# Altium project GatorSynth_Step_Sequencer.PrjPcb (part 2 of 2)

## Sheet CV_Control.SchDoc
size Letter
Used 2 times, as channels CV Control, CV Control. Parts and nets are listed once, with the designators drawn on the sheet.
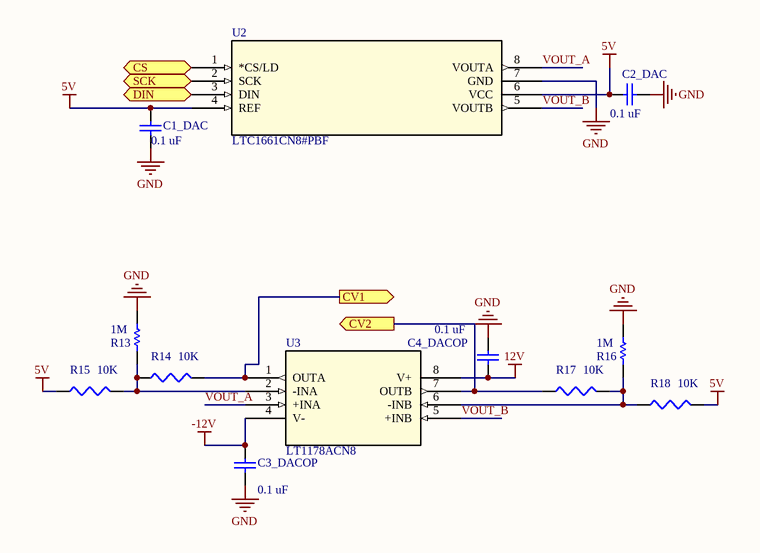
[diagram p11: CV_Control.SchDoc]

### Parts
C1_DAC  value 0.1 uF  [C0805]
C2_DAC  value 0.1 uF  [C0805]
C3_DACOP  value 0.1 uF  [C0805]
C4_DACOP  value 0.1 uF  [C0805]
R13  value 1M  [AXIAL-0.3]  (hidden comment: Res1)
R14  value 10K  [J1-0603]  (hidden comment: Res3)
R15  value 10K  [J1-0603]  (hidden comment: Res3)
R16  value 1M  [AXIAL-0.3]  (hidden comment: Res1)
R17  value 10K  [J1-0603]  (hidden comment: Res3)
R18  value 10K  [J1-0603]  (hidden comment: Res3)
U2  LTC1661CN8#PBF  [PDIP-8_N]
U3  LT1178ACN8  [PDIP-8_N]

### Ports
CS (in), CV1 (out), CV2 (out), DIN (in), SCK (in)

### Nets
5V: C1_DAC.2 C2_DAC.1 R15.1 R18.2 U2.4(REF) U2.6(VCC)
12V: C4_DACOP.1 U3.8(V+)
-12V: C3_DACOP.1 U3.4(V-)
GND: C1_DAC.1 C2_DAC.2 C3_DACOP.2 C4_DACOP.2 R13.2 R16.2 U2.7(GND)
CS: U2.1(*CS/LD) ; port CS
CV1: R14.2 U3.1(OUTA) ; port CV1
CV2: R17.1 U3.7(OUTB) ; port CV2
DIN: U2.3(DIN) ; port DIN
SCK: U2.2(SCK) ; port SCK
VOUT_A: U2.8(VOUTA) U3.3(+INA)
VOUT_B: U2.5(VOUTB) U3.5(+INB)
NetR13_1: R13.1 R14.1 R15.2 U3.2(-INA)
NetR16_1: R16.1 R17.2 R18.1 U3.6(-INB)

### Channels
CV Control: designators end in _CV_Control#1; ports CS=CS1 CV1=CV1 CV2=CV2 DIN=MOSI SCK=SPCK
CV Control: designators end in _CV_Control#2; ports CS=CS2 CV1=CV3 CV2=CV4 DIN=MOSI SCK=SPCK

### Library data of the parts
C1_DAC C2_DAC C3_DACOP C4_DACOP = Cap: Capacitor; Published: 8-Jun-2000; LatestRevisionDate: 17-Jul-2002; LatestRevisionNote: Re-released for DXP Platform.; PackageReference: RAD-0.3; Publisher: Altium Limited; PackageDescription: Radial Cap, Thru-Hole; 2 Leads; 0.3 in Pin Spacing
R13 R16 = Res1: Resistor; Published: 8-Jun-2000; LatestRevisionDate: 17-Jul-2002; LatestRevisionNote: Re-released for DXP Platform.; PackageReference: AXIAL-0.3; Publisher: Altium Limited; PackageDescription: Axial Device, Thru-Hole; 2 Leads; 0.3 in Pin Spacing
R14 R15 R17 R18 = Res3: Resistor; Published: 8-Jun-2000; LatestRevisionDate: 29-May-2009; LatestRevisionNote: IPC-7351 Footprint Added.; PackageReference: J1-0603; Publisher: Altium Limited; PackageDescription: Chip Resistor
U2 = LTC1661CN8#PBF: Imported; Vendor: Linear Technology; Manufacturer_Part_Number: LTC1661CN8#PBF; Value: Value; Type: Type; RefDes: RefDes
U3 = LT1632CN8#PBF: Imported; Operating_Temperature: 0Â°C ~ 70Â°C; Current_-_Output_/_Channel: 70mA; Voltage_-_Input_Offset: 500ÂµV; Current_-_Input_Bias: 1.15ÂµA; Output_Type: Rail-to-Rail; Vendor: Linear Technology; Amplifier_Type: General Purpose; Number_of_Circuits: 2; Slew_Rate: 45 V/Âµs; Gain_Bandwidth_Product: 45MHz; Current_-_Supply: 4.6mA; Current_-_Output/Channel: 40mA; Voltage_-_Supply,_Single/Dual_(Â±): 2.7 V ~ 36 V, Â±1.35 V ~ 18 V; Mounting_Type: Through Hole; 3D_Library_Name: Maxim2; C: Copyright (C) 2016 Accelerated Designs. All rights reserved; -3db_Bandwidth: -; Series: *; Manufacturer_Part_Number: LT1632CN8#PBF; DigiKeyPartNumber: LT1632CN8-ND; Quantity_Available: 0; DataSheet: http://www.linear.com/docs/3055; Packaging: Tube; Package_/_Case: 8-DIP (0.300", 7.62mm); Copyright: Copyright (C) 2015 Accelerated Designs. All rights reserved; Supplier_Device_Package: 8-PDIP; Value: Value; Type: Type; RefDes: RefDes

## Sheet Ribbon_Connectors.SchDoc
size Letter
Used 5 times, as channels U_Ribbon_Connectors, U_Ribbon_Connectors, U_Ribbon_Connectors, U_Ribbon_Connectors, U_Ribbon_Connectors. Parts and nets are listed once, with the designators drawn on the sheet.
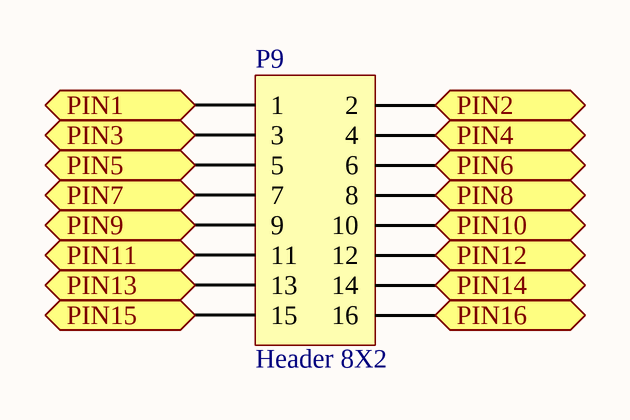
[diagram p12: Ribbon_Connectors.SchDoc]

### Parts
P9  Header 8X2  [HDR2X8]

### Ports
PIN1, PIN2, PIN3, PIN4, PIN5, PIN6, PIN7, PIN8, PIN9, PIN10, PIN11, PIN12, PIN13, PIN14, PIN15, PIN16

### Nets
PIN1: P9.1 ; port PIN1
PIN2: P9.2 ; port PIN2
PIN3: P9.3 ; port PIN3
PIN4: P9.4 ; port PIN4
PIN5: P9.5 ; port PIN5
PIN6: P9.6 ; port PIN6
PIN7: P9.7 ; port PIN7
PIN8: P9.8 ; port PIN8
PIN9: P9.9 ; port PIN9
PIN10: P9.10 ; port PIN10
PIN11: P9.11 ; port PIN11
PIN12: P9.12 ; port PIN12
PIN13: P9.13 ; port PIN13
PIN14: P9.14 ; port PIN14
PIN15: P9.15 ; port PIN15
PIN16: P9.16 ; port PIN16

### Channels
U_Ribbon_Connectors: designators end in _U_Ribbon_Connectors#1; ports PIN1=NE_L0 PIN2=NE_R0 PIN3=NE_L1 PIN4=NE_R1 PIN5=NE_L2 PIN6=NE_R2 PIN7=NE_L3 PIN8=NE_R3 PIN9=NE_L4 PIN10=NE_R4 PIN11=NE_L5 PIN12=NE_R5 PIN13=NE_L6 PIN14=NE_R6 PIN15=NE_L7 PIN16=NE_R7
U_Ribbon_Connectors: designators end in _U_Ribbon_Connectors#2; ports PIN1=NE_L8 PIN2=NE_R8 PIN3=NE_L9 PIN4=NE_R9 PIN5=NE_L10 PIN6=NE_R10 PIN7=NE_L11 PIN8=NE_R11 PIN9=NE_L12 PIN10=NE_R12 PIN11=NE_L13 PIN12=NE_R13 PIN13=NE_L14 PIN14=NE_R14 PIN15=NE_L15 PIN16=NE_R15
U_Ribbon_Connectors: designators end in _U_Ribbon_Connectors#3; ports PIN1=AE_L0 PIN2=AE_R0 PIN3=AE_L1 PIN4=AE_R1 PIN5=AE_L2 PIN6=AE_R2 PIN7=AE_L3 PIN8=AE_R3 PIN9=AE_L4 PIN10=AE_R4 PIN11=AE_L5 PIN12=AE_R5 PIN13=AE_L6 PIN14=AE_R6 PIN15=AE_L7 PIN16=AE_R7
U_Ribbon_Connectors: designators end in _U_Ribbon_Connectors#4; ports PIN1=ENC_INT PIN2=BTN_INT PIN3=SDA PIN4=SCL PIN5=MOSI PIN6=SPCK PIN7=NOTE_LEN PIN8=DISP_SEL0 PIN9=DISP_SEL1 PIN10=DISP_SEL2 PIN11=DISP_RESET PIN12=PP_BTN PIN13=PP_LED PIN14=NetP9_U_Ribbon_Connectors#4_14 PIN15=NetP9_U_Ribbon_Connectors#4_15 PIN16=NetP9_U_Ribbon_Connectors#4_16
U_Ribbon_Connectors: designators end in _U_Ribbon_Connectors#5; ports PIN1=12V PIN2=12V PIN3=12V PIN4=12V PIN5=12V PIN6=3.3V PIN7=3.3V PIN8=3.3V PIN9=3.3V PIN10=3.3V PIN11=GND PIN12=GND PIN13=GND PIN14=GND PIN15=GND PIN16=GND

### Library data of the parts
P9 = Header 8X2: Header, 8-Pin, Dual row; LatestRevisionDate: 17-Jul-2002; LatestRevisionNote: Re-released for DXP Platform.; Publisher: Altium Limited

## Nets that join several sheets
3.3V: Top_Level (R4.2 R25.2), Programmer (J4.1), Processor (12 pins), Buttons (16 pins), Jack_In (R31.2), Digital_Io (C1_IOOP.1 U5.8), ButtonExpanders (8 pins), NoteExpanders (8 pins), Power (C7_PWR.2 C28.1 L1.2 R33.1), Display_Mux (U8.16), U_Ribbon_Connectors (5 pins)
5V: Power (C1_PWR.2 C4_PWR.1 P9.5 P9.6), CV Control (6 pins), CV Control (6 pins)
12V: Gate Control (C2_GC_Gate_Control#1.1 U4_Gate_Control#1.8), Buttons (16 pins), Digital_Io (C3_IOOP.1 U6.8), Power (8 pins), Gate Control (C2_GC_Gate_Control#2.1 U4_Gate_Control#2.8), CV Control (C4_DACOP_CV_Control#1.1 U3_CV_Control#1.8), CV Control (C4_DACOP_CV_Control#2.1 U3_CV_Control#2.8), U_Ribbon_Connectors (5 pins)
-12V: Gate Control (C1_GC_Gate_Control#1.2 U4_Gate_Control#1.4), Digital_Io (C2_IOOP.2 U6.4), Power (C3_PWR.2 C6_PWR.2 P9.15 P9.16), Gate Control (C1_GC_Gate_Control#2.2 U4_Gate_Control#2.4), CV Control (C3_DACOP_CV_Control#1.1 U3_CV_Control#1.4), CV Control (C3_DACOP_CV_Control#2.1 U3_CV_Control#2.4)
GND: Top_Level (5 pins), Programmer (J4.3 J4.5 J4.9), Gate Control (C1_GC_Gate_Control#1.1 C2_GC_Gate_Control#1.2 R20_Gate_Control#1.1 R22_Gate_Control#1.2), Processor (17 pins), Buttons (36 pins), Jack_In (J6.3 J6.5), Digital_Io (7 pins), ButtonExpanders (C23_ButtonExpanders.2 EXP1_ButtonExpanders.3 EXP1_ButtonExpanders.12), NoteExpanders (C23_NoteExpanders.2 EXP1_NoteExpanders.3 EXP1_NoteExpanders.12), Power (18 pins), Display_Mux (U8.6 U8.7 U8.8), Gate Control (C1_GC_Gate_Control#2.1 C2_GC_Gate_Control#2.2 R20_Gate_Control#2.1 R22_Gate_Control#2.2), CV Control (7 pins), CV Control (7 pins), U_Ribbon_Connectors (6 pins)
AE_L0: Processor (U1.74), U_Ribbon_Connectors (P9_U_Ribbon_Connectors#3.1)
AE_L1: Processor (U1.52), U_Ribbon_Connectors (P9_U_Ribbon_Connectors#3.3)
AE_L2: Processor (U1.48), U_Ribbon_Connectors (P9_U_Ribbon_Connectors#3.5)
AE_L3: Processor (U1.28), U_Ribbon_Connectors (P9_U_Ribbon_Connectors#3.7)
AE_L4: Processor (U1.24), U_Ribbon_Connectors (P9_U_Ribbon_Connectors#3.9)
AE_L5: Processor (U1.20), U_Ribbon_Connectors (P9_U_Ribbon_Connectors#3.11)
AE_L6: Processor (U1.34), U_Ribbon_Connectors (P9_U_Ribbon_Connectors#3.13)
AE_L7: Processor (U1.39), U_Ribbon_Connectors (P9_U_Ribbon_Connectors#3.15)
AE_R0: Processor (U1.72), U_Ribbon_Connectors (P9_U_Ribbon_Connectors#3.2)
AE_R1: Processor (U1.49), U_Ribbon_Connectors (P9_U_Ribbon_Connectors#3.4)
AE_R2: Processor (U1.46), U_Ribbon_Connectors (P9_U_Ribbon_Connectors#3.6)
AE_R3: Processor (U1.12), U_Ribbon_Connectors (P9_U_Ribbon_Connectors#3.8)
AE_R4: Processor (U1.15), U_Ribbon_Connectors (P9_U_Ribbon_Connectors#3.10)
AE_R5: Processor (U1.22), U_Ribbon_Connectors (P9_U_Ribbon_Connectors#3.12)
AE_R6: Processor (U1.38), U_Ribbon_Connectors (P9_U_Ribbon_Connectors#3.14)
AE_R7: Processor (U1.57), U_Ribbon_Connectors (P9_U_Ribbon_Connectors#3.16)
BPM_IN: Jack_In (J6.1), Digital_Io (U5.3)
BPM_OUT: Processor (U1.41), Digital_Io (U6.3)
BPM_TRIG: Processor (U1.53), Digital_Io (C26.1 D1.2 R23.2 U5.1)
BTN_INT: Processor (U1.88), ButtonExpanders (EXP1_ButtonExpanders.1 R10_ButtonExpanders.1), U_Ribbon_Connectors (P9_U_Ribbon_Connectors#4.2)
CS1: Processor (U1.93), CV Control (U2_CV_Control#1.1)
CS2: Processor (U1.99), CV Control (U2_CV_Control#2.1)
DISP_RESET: Processor (U1.81), U_Ribbon_Connectors (P9_U_Ribbon_Connectors#4.11)
DISP_SEL0: Processor (U1.59), Display_Mux (U8.11), U_Ribbon_Connectors (P9_U_Ribbon_Connectors#4.8)
DISP_SEL1: Processor (U1.63), Display_Mux (U8.10), U_Ribbon_Connectors (P9_U_Ribbon_Connectors#4.9)
DISP_SEL2: Processor (U1.64), Display_Mux (U8.9), U_Ribbon_Connectors (P9_U_Ribbon_Connectors#4.10)
ENC_INT: Processor (U1.89), NoteExpanders (EXP1_NoteExpanders.1 R10_NoteExpanders.1), U_Ribbon_Connectors (P9_U_Ribbon_Connectors#4.1)
GATE_OUT1: Processor (U1.3), Gate Control (U4_Gate_Control#2.3)
GATE_OUT2: Processor (U1.5), Gate Control (U4_Gate_Control#2.5)
GATE_OUT3: Gate Control (U4_Gate_Control#1.3), Processor (U1.7)
GATE_OUT4: Gate Control (U4_Gate_Control#1.5), Processor (U1.9)
JACK_INT: Processor (U1.44), Jack_In (J6.4 R31.1)
MOSI: Processor (U1.33), Buttons (DRV1.9), CV Control (U2_CV_Control#1.3), CV Control (U2_CV_Control#2.3), U_Ribbon_Connectors (P9_U_Ribbon_Connectors#4.5)
NE_L0: Processor (U1.25), U_Ribbon_Connectors (P9_U_Ribbon_Connectors#1.1)
NE_L1: Processor (U1.43), U_Ribbon_Connectors (P9_U_Ribbon_Connectors#1.3)
NE_L2: Processor (U1.37), U_Ribbon_Connectors (P9_U_Ribbon_Connectors#1.5)
NE_L3: Processor (U1.32), U_Ribbon_Connectors (P9_U_Ribbon_Connectors#1.7)
NE_L4: Processor (U1.58), U_Ribbon_Connectors (P9_U_Ribbon_Connectors#1.9)
NE_L5: Processor (U1.65), U_Ribbon_Connectors (P9_U_Ribbon_Connectors#1.11)
NE_L6: Processor (U1.23), U_Ribbon_Connectors (P9_U_Ribbon_Connectors#1.13)
NE_L7: Processor (U1.71), U_Ribbon_Connectors (P9_U_Ribbon_Connectors#1.15)
NE_L8: Processor (U1.73), U_Ribbon_Connectors (P9_U_Ribbon_Connectors#2.1)
NE_L9: Processor (U1.78), U_Ribbon_Connectors (P9_U_Ribbon_Connectors#2.3)
NE_L10: Processor (U1.82), U_Ribbon_Connectors (P9_U_Ribbon_Connectors#2.5)
NE_L11: Processor (U1.86), U_Ribbon_Connectors (P9_U_Ribbon_Connectors#2.7)
NE_L12: Processor (U1.92), U_Ribbon_Connectors (P9_U_Ribbon_Connectors#2.9)
NE_L13: Processor (U1.13), U_Ribbon_Connectors (P9_U_Ribbon_Connectors#2.11)
NE_L14: Processor (U1.54), U_Ribbon_Connectors (P9_U_Ribbon_Connectors#2.13)
NE_L15: Processor (U1.6), U_Ribbon_Connectors (P9_U_Ribbon_Connectors#2.15)
NE_R0: Processor (U1.47), U_Ribbon_Connectors (P9_U_Ribbon_Connectors#1.2)
NE_R1: Processor (U1.40), U_Ribbon_Connectors (P9_U_Ribbon_Connectors#1.4)
NE_R2: Processor (U1.35), U_Ribbon_Connectors (P9_U_Ribbon_Connectors#1.6)
NE_R3: Processor (U1.29), U_Ribbon_Connectors (P9_U_Ribbon_Connectors#1.8)
NE_R4: Processor (U1.62), U_Ribbon_Connectors (P9_U_Ribbon_Connectors#1.10)
NE_R5: Processor (U1.68), U_Ribbon_Connectors (P9_U_Ribbon_Connectors#1.12)
NE_R6: Processor (U1.21), U_Ribbon_Connectors (P9_U_Ribbon_Connectors#1.14)
NE_R7: Processor (U1.19), U_Ribbon_Connectors (P9_U_Ribbon_Connectors#1.16)
NE_R8: Processor (U1.75), U_Ribbon_Connectors (P9_U_Ribbon_Connectors#2.2)
NE_R9: Processor (U1.80), U_Ribbon_Connectors (P9_U_Ribbon_Connectors#2.4)
NE_R10: Processor (U1.84), U_Ribbon_Connectors (P9_U_Ribbon_Connectors#2.6)
NE_R11: Processor (U1.90), U_Ribbon_Connectors (P9_U_Ribbon_Connectors#2.8)
NE_R12: Processor (U1.94), U_Ribbon_Connectors (P9_U_Ribbon_Connectors#2.10)
NE_R13: Processor (U1.17), U_Ribbon_Connectors (P9_U_Ribbon_Connectors#2.12)
NE_R14: Processor (U1.4), U_Ribbon_Connectors (P9_U_Ribbon_Connectors#2.14)
NE_R15: Processor (U1.8), U_Ribbon_Connectors (P9_U_Ribbon_Connectors#2.16)
NetJ4_2: Programmer (J4.2), Processor (U1.79)
NetJ4_4: Programmer (J4.4), Processor (U1.83)
NetJ4_6: Programmer (J4.6), Processor (U1.76)
NetJ4_8: Programmer (J4.8), Processor (U1.51)
NetJ4_10: Programmer (J4.10), Processor (U1.60)
NOTE_LEN: Top_Level (R4.3), Processor (U1.18), U_Ribbon_Connectors (P9_U_Ribbon_Connectors#4.7)
PLAY/PAUSE_LED: Processor (U1.14), Digital_Io (U6.5)
PP_BTN: Top_Level (P8.SIG2 R25.1), Processor (U1.67), U_Ribbon_Connectors (P9_U_Ribbon_Connectors#4.12)
PP_LED: Top_Level (P8.GRN1), Digital_Io (R26.2), U_Ribbon_Connectors (P9_U_Ribbon_Connectors#4.13)
SCL: Processor (R_SCL.1 U1.55), ButtonExpanders (EXP1_ButtonExpanders.22), NoteExpanders (EXP1_NoteExpanders.22), U_Ribbon_Connectors (P9_U_Ribbon_Connectors#4.4)
SDA: Processor (R_SDA.1 U1.66), ButtonExpanders (EXP1_ButtonExpanders.23), NoteExpanders (EXP1_NoteExpanders.23), Display_Mux (U8.3), U_Ribbon_Connectors (P9_U_Ribbon_Connectors#4.3)
SPCK: Processor (U1.31), Buttons (DRV1.10), CV Control (U2_CV_Control#1.2), CV Control (U2_CV_Control#2.2), U_Ribbon_Connectors (P9_U_Ribbon_Connectors#4.6)
SW1: Buttons (P1.SIG2), ButtonExpanders (EXP1_ButtonExpanders.4 R11_ButtonExpanders.1)
SW2: Buttons (P1.SIG4), ButtonExpanders (EXP1_ButtonExpanders.5 R11_ButtonExpanders.2)
SW3: Buttons (P2.SIG2), ButtonExpanders (EXP1_ButtonExpanders.6 R11_ButtonExpanders.3)
SW4: Buttons (P2.SIG4), ButtonExpanders (EXP1_ButtonExpanders.7 R11_ButtonExpanders.4)
SW5: Buttons (P3.SIG2), ButtonExpanders (EXP1_ButtonExpanders.8 R11_ButtonExpanders.9)
SW6: Buttons (P3.SIG4), ButtonExpanders (EXP1_ButtonExpanders.9 R11_ButtonExpanders.8)
SW7: Buttons (P4.SIG2), ButtonExpanders (EXP1_ButtonExpanders.10 R11_ButtonExpanders.7)
SW8: Buttons (P4.SIG4), ButtonExpanders (EXP1_ButtonExpanders.11 R11_ButtonExpanders.6)
SW9: Buttons (P1.SIG6), ButtonExpanders (EXP1_ButtonExpanders.13 R12_ButtonExpanders.6)
SW10: Buttons (P1.SIG8), ButtonExpanders (EXP1_ButtonExpanders.14 R12_ButtonExpanders.7)
SW11: Buttons (P2.SIG6), ButtonExpanders (EXP1_ButtonExpanders.15 R12_ButtonExpanders.8)
SW12: Buttons (P2.SIG8), ButtonExpanders (EXP1_ButtonExpanders.16 R12_ButtonExpanders.9)
SW13: Buttons (P3.SIG6), ButtonExpanders (EXP1_ButtonExpanders.17 R12_ButtonExpanders.4)
SW14: Buttons (P3.SIG8), ButtonExpanders (EXP1_ButtonExpanders.18 R12_ButtonExpanders.3)
SW15: Buttons (P4.SIG6), ButtonExpanders (EXP1_ButtonExpanders.19 R12_ButtonExpanders.2)
SW16: Buttons (P4.SIG8), ButtonExpanders (EXP1_ButtonExpanders.20 R12_ButtonExpanders.1)